# EAGLE design feelerBox1_2_3 (EAGLE 7.2.0)
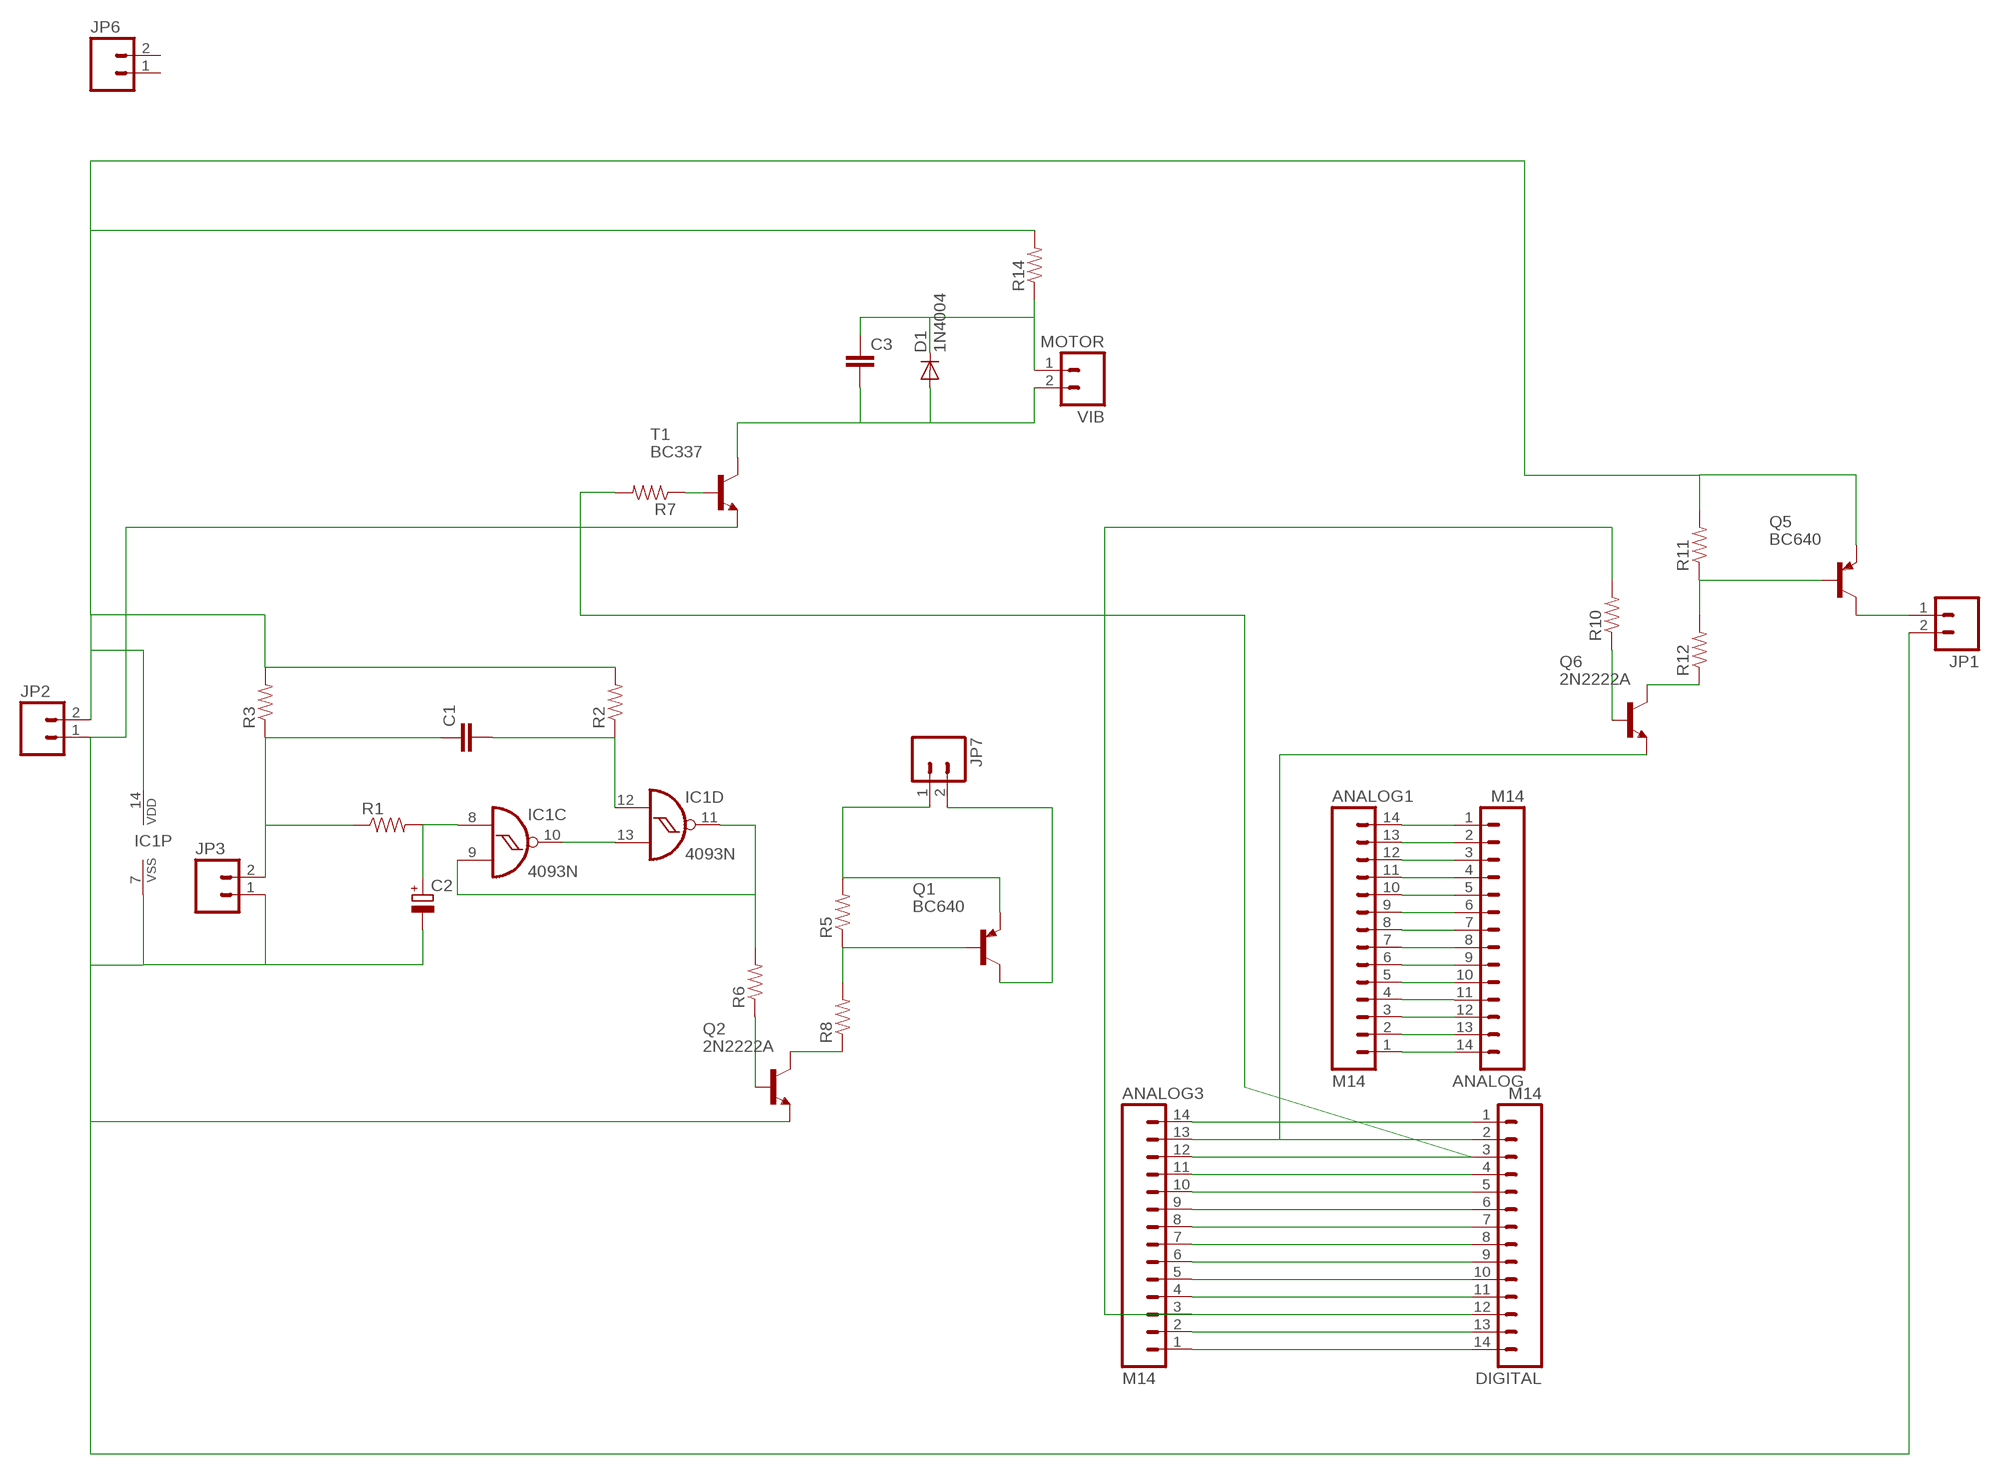
[diagram p0: schematic, sheet 1]

## Parts
ANALOG  M14  [1X14]
ANALOG1  M14  [1X14]
ANALOG3  M14  [1X14]
C1  0.1UF-50V-20%(PTH)KIT-EZ  [CAP-PTH-SMALL-KIT]
C2  CPOL-EUE2.5-5  [E2,5-5]
C3  CAPKIT  [CAP-PTH-SMALL-KIT]
D1  1N4004  [DO41-10]
DIGITAL  M14  [1X14]
IC1  4093N  [DIL14]
JP1  M02PTH  [1X02]
JP2  M02PTH  [1X02]
JP3  M02PTH  [1X02]
JP6  M02PTH  [1X02]
JP7  M02PTH  [1X02]
Q1  BC640  [TO92-BCE]
Q2  2N2222A  [TO18]
Q5  BC640  [TO92-BCE]
Q6  2N2222A  [TO18]
R1  RESISTORAXIAL-0.3  [AXIAL-0.3]
R2  RESISTORAXIAL-0.3  [AXIAL-0.3]
R3  RESISTORAXIAL-0.3  [AXIAL-0.3]
R5  RESISTORPTH-1/4W-VERT  [AXIAL-0.1]
R6  RESISTORAXIAL-0.3  [AXIAL-0.3]
R7  RESISTORAXIAL-0.3  [AXIAL-0.3]
R8  RESISTORAXIAL-0.3  [AXIAL-0.3]
R10  RESISTORPTH-1/4W-VERT  [AXIAL-0.1]
R11  RESISTORPTH-1/4W-VERT  [AXIAL-0.1]
R12  RESISTORPTH-1/4W-VERT  [AXIAL-0.1]
R14  RESISTORPTH-1/4W-VERT  [AXIAL-0.1]
T1  BC337  [TO92]
VIB  MOTOR  M02PTH  [1X02]

## Nets
A1: IC1.9(C:I1) IC1.11(D:O) R6.P$2
A2: ANALOG1.6 ANALOG.9
A3: ANALOG1.5 ANALOG.10
A4: ANALOG1.4 ANALOG.11
A5: ANALOG1.3 ANALOG.12
A6: ANALOG1.2 ANALOG.13
A7: ANALOG1.1 ANALOG.14
A8: ANALOG3.4 DIGITAL.11
A9: ANALOG3.3 DIGITAL.12 R10.P$2
BATTERYGND: C2.- IC1.7(P:VSS) JP1.2 JP2.1 JP3.1 Q2.1(E) T1.1(E)
BATTERYPWR: IC1.14(P:VDD) JP2.2 Q5.E R2.P$2 R3.P$2 R11.P$2 R14.P$2
D2: ANALOG3.12 DIGITAL.3 R7.P$2
D4: ANALOG3.10 DIGITAL.5
D6: ANALOG3.8 DIGITAL.7
D7: ANALOG3.7 DIGITAL.8
D8: ANALOG3.6 DIGITAL.9
D9: ANALOG3.5 DIGITAL.10
GND: ANALOG3.13 DIGITAL.2 Q6.1(E)
GND2: ANALOG3.14 DIGITAL.1
N$1: IC1.10(C:O) IC1.13(D:I1)
N$2: Q1.B R5.P$1 R8.P$2
N$3: C2.+ IC1.8(C:I0) R1.P$2
N$5: ANALOG1.9 ANALOG.6
N$6: C1.1 JP3.2 R1.P$1 R3.P$1
N$7: C1.2 IC1.12(D:I0) R2.P$1
N$8: Q2.3(C) R8.P$1
N$9: JP7.2 Q1.C
N$10: Q2.2(B) R6.P$1
N$11: JP7.1 Q1.E R5.P$2
N$12: ANALOG1.14 ANALOG.1
N$13: ANALOG1.13 ANALOG.2
N$14: ANALOG1.12 ANALOG.3
N$15: ANALOG1.11 ANALOG.4
N$16: ANALOG1.10 ANALOG.5
N$17: R7.P$1 T1.2(B)
N$18: ANALOG1.8 ANALOG.7
N$19: ANALOG1.7 ANALOG.8
N$24: Q5.B R11.P$1 R12.P$2
N$26: ANALOG3.1 DIGITAL.14
N$27: ANALOG3.2 DIGITAL.13
N$29: ANALOG3.9 DIGITAL.6
N$30: ANALOG3.11 DIGITAL.4
N$36: Q6.3(C) R12.P$1
N$37: C3.2 D1.A T1.3(C) VIB.2
N$38: C3.1 D1.C R14.P$1 VIB.1
N$39: Q6.2(B) R10.P$1
N$41: JP1.1 Q5.C
Unconnected: IC1.1(A:I0) IC1.2(A:I1) IC1.3(A:O) IC1.4(B:O) IC1.5(B:I0) IC1.6(B:I1) JP6.1 JP6.2

## Library data of the parts
ANALOG ANALOG1 ANALOG3 DIGITAL = SparkFun:M14: Header 14 Standard 14-pin 0.1" header. Use with straight break away headers (SKU : PRT-00116), right angle break away headers (PRT-00553), swiss pins (PRT-00743), machine pins (PRT-00117), and female headers (PRT-00115).
C1 = SparkFun-Capacitors:0.1UF-50V-20%(PTH): CAP-08370; PROD_ID: CAP-08370
C2 = rcl:CPOL-EU: POLARIZED CAPACITOR, European symbol
C3 = SparkFun-Capacitors:CAP: Capacitor Standard 0603 ceramic capacitor, and 0.1" leaded capacitor.
D1 = diode:1N4004: DIODE general purpose rectifier, 1 A
IC1 = 40xx:4093: Quad 2-input NAND schmitt trigger
JP1-JP3 JP6 JP7 VIB = SparkFun:M02: Header 2 Standard 2-pin 0.1" header. Use with straight break away headers (SKU : PRT-00116), right angle break away headers (PRT-00553), swiss pins (PRT-00743), machine pins (PRT-00117), and female headers (PRT-00115). Molex polarized connector foot print use with SKU : PRT-08233 with associated crimp pins and housings.
Q1 Q5 = transistor-pnp:BC640*: PNP Transistror
Q2 Q6 = transistor-npn:2N2222*: NPN Transistor
R1-R3 R5-R8 R10-R12 R14 = SparkFun-Resistors:RESISTOR: Resistor Basic schematic elements and footprints for 0603, 1206, and PTH resistors.
T1 = transistor:BC337: NPN TRANSISTOR

## Net classes
0 Default: width 0.203 mm
1 VCC: width 0.381 mm
2 LEDPower: width 0.203 mm
3 ButtonSignal: width 0.203 mm

## Board
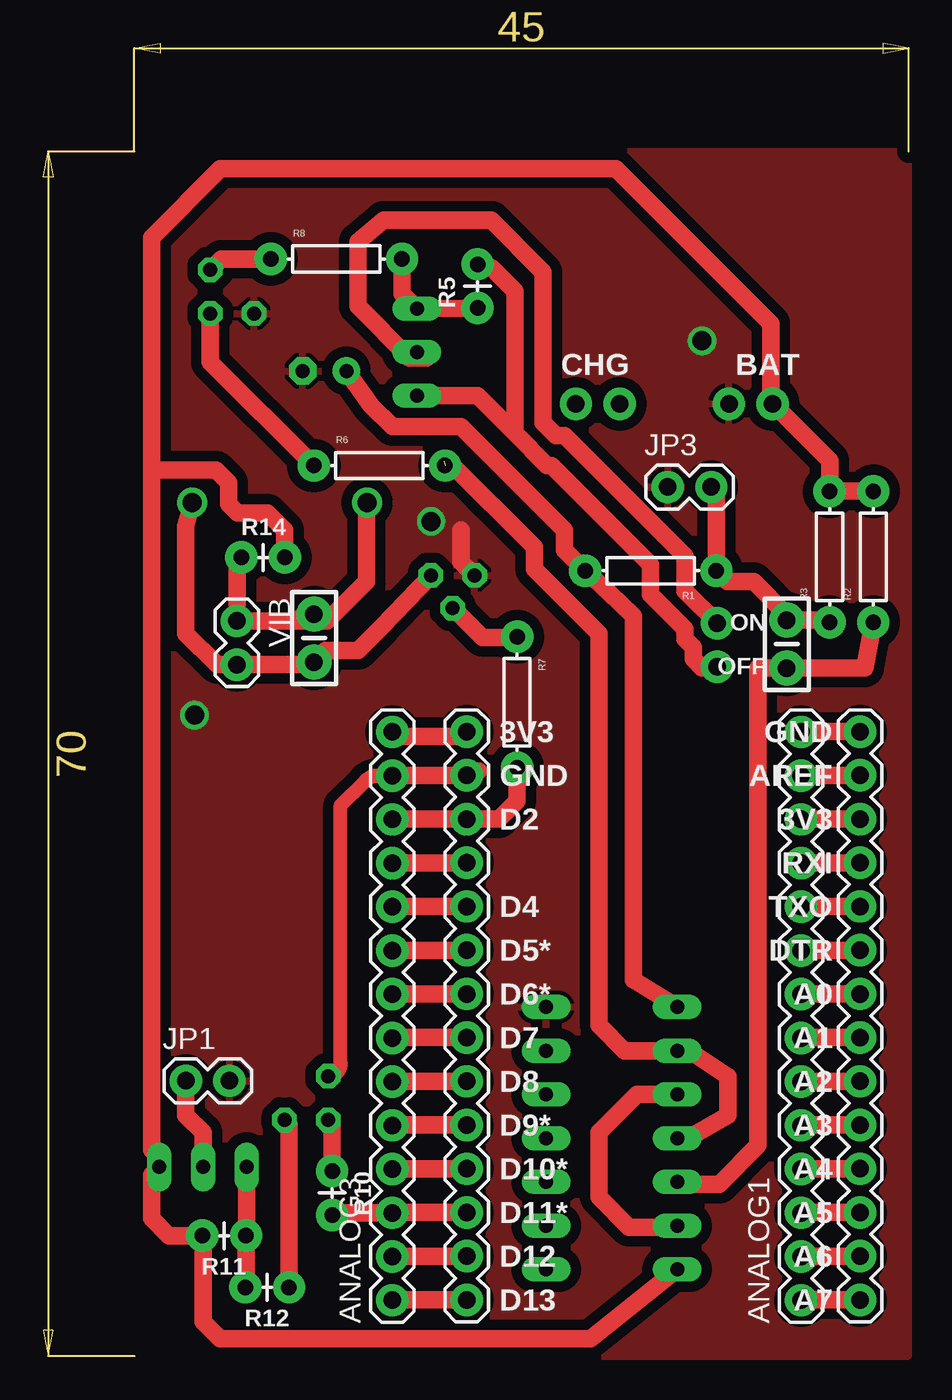
[diagram p1: board, top side]
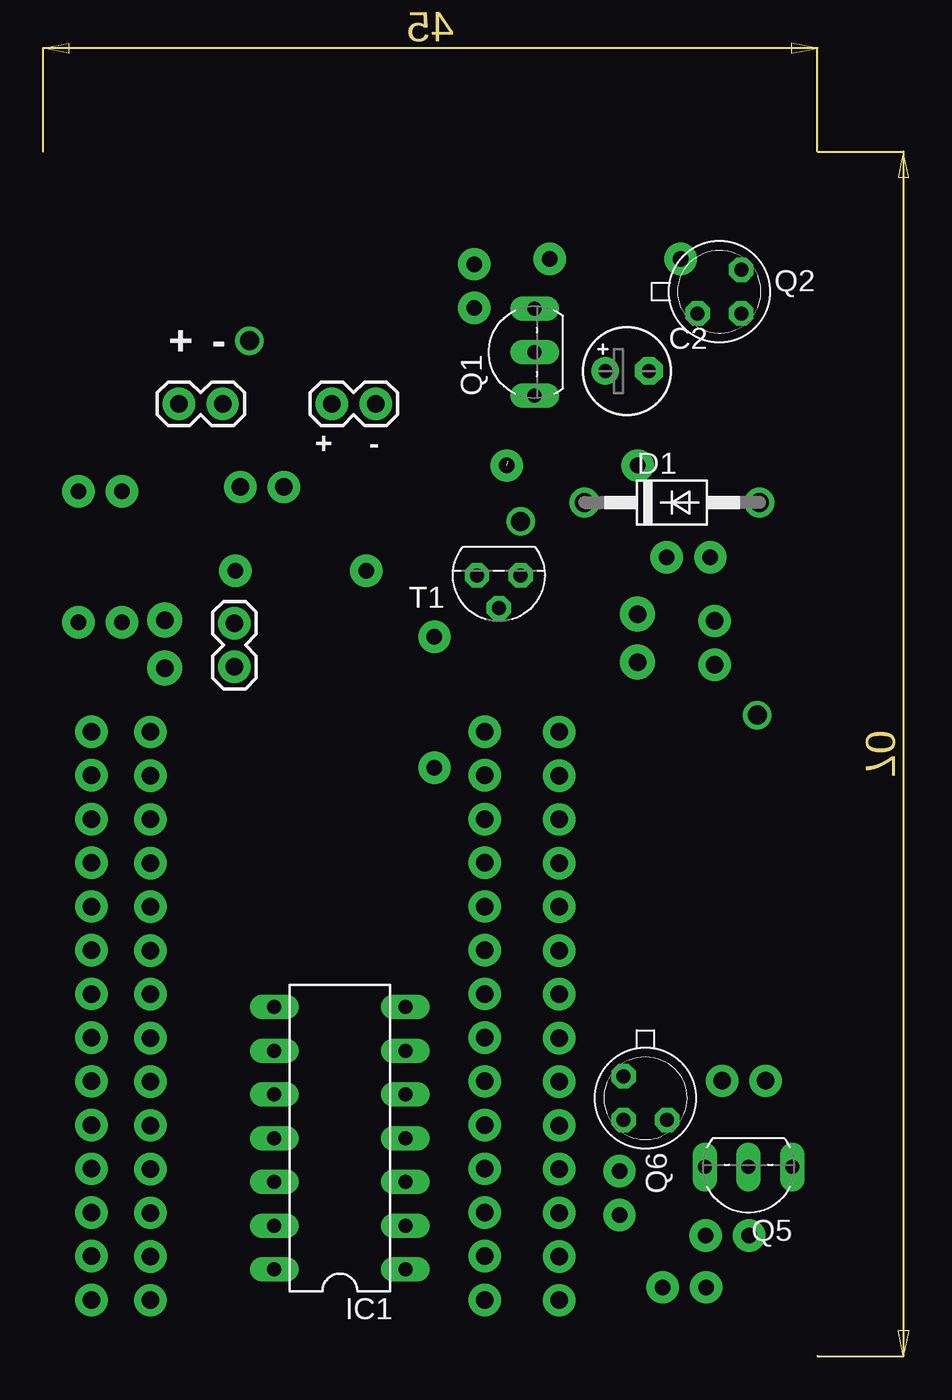
[diagram p2: board, bottom side, seen from below]

Size 50.3 x 76.3 mm. Coordinates in mm from the lower left corner, seen from the top.
Copper layers (1*16): Top 0.035mm / dielectric 1.5mm / Bottom 0.035mm
Design rules "SparkFun *": minimum track width 8mil, minimum drill 20mil, track to track 8mil, track to pad 8mil, pad to pad 8mil, via to via 8mil, smd to smd 8mil, copper to edge 10mil, drill to drill 8mil, minimum pad ring 12mil, minimum via ring 10mil, stop-mask expansion 4mil, vias tented up to drill 25mil, thermal gap 10mil

### Footprints (pad centres in the part's own frame; a part is rotated, then mirrored left to right if it is on the bottom)
1X14 = drill 1.016 pad 1.88: 1 0,0; 2 2.54,0; 3 5.08,0; 4 7.62,0; 5 10.16,0; 6 12.7,0; 7 15.24,0; 8 17.78,0; 9 20.32,0; 10 22.86,0; 11 25.4,0; 12 27.94,0; 13 30.48,0; 14 33.02,0
CAP-PTH-SMALL-KIT = drill 1.016 pad 2.032: 1 -1.397,0; 2 1.397,0
E2,5-5 = drill 0.813 pad 1.6: + -1.27,0 | drill 0.813 pad 1.6 octagon: - 1.27,0
DO41-10 = drill 1.118: A 5.08,0; C -5.08,0
DIL14 = drill 0.813 long: 1 -7.62,-3.81; 2 -5.08,-3.81; 3 -2.54,-3.81; 4 0,-3.81; 5 2.54,-3.81; 6 5.08,-3.81; 7 7.62,-3.81; 8 7.62,3.81; 9 5.08,3.81; 10 2.54,3.81; 11 0,3.81; 12 -2.54,3.81; 13 -5.08,3.81; 14 -7.62,3.81
1X02 = drill 1.016 pad 1.88: 1 0,0; 2 2.54,0
TO92-BCE = drill 0.813 long: B 2.54,0; C 0,0; E -2.54,0
TO18 = drill 0.813 octagon: 1 -1.27,-1.27; 2 1.27,-1.27; 3 1.27,1.27
AXIAL-0.3 = drill 0.9 pad 1.88: P$1 -3.81,0; P$2 3.81,0
AXIAL-0.1 = drill 0.9 pad 1.88: P$1 0,0; P$2 2.54,0
TO92 = drill 0.813 octagon: 1 1.27,0; 2 0,1.905; 3 -1.27,0

### Placement (x,y rotation side)
ANALOG  47.48,36.29 270 top
ANALOG1  44.05,3.25 90 top
ANALOG3  20.3,3.25 90 top
C1  43.22,41.37 270 top
C2  16.36,57.24 0 bottom
C3  15.75,41.72 270 top
D1  13.75,49.6 0 bottom
DIGITAL  24.62,36.29 270 top
IC1  33.05,12.67 90 bottom
JP1  8.3,16 0 top
JP2  39.86,55.34 180 bottom
JP3  36.3,50.5 0 top
JP6  30.97,55.34 180 bottom
JP7  39.17,40.05 90 bottom
Q1  21.73,58.34 90 bottom
Q2  10.99,61.86 0 bottom
Q5  9.3,11 180 bottom
Q6  15.3,15 270 bottom
R1  35.32,45.64 180 top
R2  48.25,46.45 90 top
R3  45.71,46.45 90 top
R5  25.25,60.91 90 top
R6  19.55,51.75 0 top
R7  27.55,38 270 top
R8  17.05,63.75 0 top
R10  16.8,10.75 270 top
R11  11.8,7 180 top
R12  14.3,4 180 top
R14  11.52,46.41 0 top
T1  23.81,45.37 180 bottom
VIB  11.27,42.72 270 top

### Tracks (layer width: path | path; a pad name or v marks a point on that pad's centre or on a via)
A1  (1 unrouted)
  Top 1.016: IC1.11 37.47,12.67 39.8,14 39.8,16.25 37.55,17.75 IC1.9 33.8,17.75 32.3,19.25 32.3,42 28.55,45.75 28.55,47 23.55,52 23.3,52
A2
  Top 1.016: ANALOG1.6 44.07,15.97 ANALOG.9
A3
  Top 1.016: ANALOG1.5 44.07,13.43 ANALOG.10
A4
  Top 1.016: ANALOG1.4 44.07,10.89 ANALOG.11
A5
  Top 1.016: ANALOG1.3 44.07,8.35 ANALOG.12
A6
  Top 1.016: ANALOG1.2 44.07,5.81 ANALOG.13
A7
  Top 1.016: ANALOG1.1 44.07,3.27 ANALOG.14
A8
  Top 1.016: ANALOG3.4 20.32,10.89 DIGITAL.11
A9
  Top 1.016: R10.P$2 16.92,8.33 ANALOG3.3 20.32,8.35 DIGITAL.12
BATTERYGND  (via drill 1.1)
  Top 0.813: JP2.1 39.52,55
  Top 1.016: T1.1 24.3,46.15 24.3,48
  other vias: 38.3,59 8.8,37.25 22.55,48.5
  pour Top (isolate 0.61): 5.3,0 50.3,0 50.3,70 5.3,70
BATTERYPWR
  Top 1.016: 6.3,51.5 6.3,65 10.3,69 33.3,69 42.3,60 42.3,55.44 JP2.2 45.71,52.03 R3.P$2 R2.P$2 | 6.3,51.5 6.3,12 6.76,11.54 Q5.E 6.3,10.54 6.3,8 7.3,7 R11.P$2 9.3,6.96 9.3,2 10.3,1 31.81,1 IC1.14 | R14.P$2 14.05,48 13.05,49 11.3,49 10.8,49.5 10.8,50.75 10.05,51.5 6.3,51.5
D2
  Top 1.016: ANALOG3.12 20.32,31.21 DIGITAL.3 26.51,31.21 27.55,32.25 R7.P$2
D4
  Top 1.016: ANALOG3.10 20.32,26.13 DIGITAL.5
D6
  Top 1.016: ANALOG3.8 20.32,21.05 DIGITAL.7
D7
  Top 1.016: ANALOG3.7 20.32,18.51 DIGITAL.8
D8
  Top 1.016: 24.35,15.7 DIGITAL.9 20.32,15.97 ANALOG3.6
D9
  Top 1.016: 24.35,13.16 DIGITAL.10 20.32,13.43 ANALOG3.5
GND
  Top 0.813: Q6.1 arc90 17.3,17 17.3,32 18.74,33.44 arc-45 19.44,33.73 ANALOG3.13
  Top 1.016: 24.35,33.48 DIGITAL.2 20.32,33.75 ANALOG3.13
GND2
  Top 1.016: 24.35,36.02 DIGITAL.1 24.59,36.29 24.3,36 20.57,36 ANALOG3.14
N$1
  Top 1.016: IC1.13 35.77,7.5 34.05,7.5 32.3,9.25 32.3,13 34.51,15.21 IC1.10
N$2
  Top 1.016: R5.P$1 21.97,60.88 Q1.B 20.86,61.75 R8.P$2
N$3
  Top 1.016: IC1.8 34.3,21.85 34.3,43 33.51,43.79 R1.P$2 30.3,46.85 30.3,48 24.3,54 20.3,54 19.06,55.24 C2.+
N$5
  Top 1.016: ANALOG1.9 44.07,23.59 ANALOG.6
N$6
  Top 1.016: JP3.2 39.13,50.21 R1.P$1 39.77,45 41.3,45 43.22,43.08 C1.1 45.58,42.77 R3.P$1
N$7
  Top 1.016: R2.P$1 47.75,39.97 C1.2 41.55,39.97 41.55,12.25 39.3,10 35.99,10 IC1.12
N$8
  Top 1.016: Q2.3 10.34,63.75 R8.P$1
N$9
  Top 1.016: JP7.2 37.3,44.47 37.3,46.5 30.3,53.5 29.8,53.5 29.05,54.25 29.05,63 26.05,66 19.8,66 18.3,64.75 18.3,61 21.3,58 22.3,58 21.96,58.34 Q1.C
N$10
  Top 1.016: R6.P$1 9.72,57.77 Q2.2
N$11
  Top 1.016: JP7.1 39.3,40 38.3,40 37.8,40.5 37.8,41.17 37.3,41.67 37.3,42.25 35.3,44.25 35.3,46 29.55,51.75 29.3,51.75 27.43,53.62 | 27.43,53.62 25.25,55.8 Q1.E | R5.P$2 25.45,63.25 26.05,63.25 27.43,61.88 27.43,53.62
N$12
  Top 1.016: ANALOG1.14 44.07,36.29 ANALOG.1
N$13
  Top 1.016: ANALOG1.13 44.07,33.75 ANALOG.2
N$14
  Top 1.016: ANALOG1.12 44.07,31.21 ANALOG.3
N$15
  Top 1.016: ANALOG1.11 44.07,28.67 ANALOG.4
N$16
  Top 1.016: ANALOG1.10 44.07,26.13 ANALOG.5
N$17
  Top 1.016: R7.P$1 27.49,41.75 25.55,41.75 23.84,43.47 T1.2
N$18
  Top 1.016: ANALOG1.8 44.07,21.05 ANALOG.7
N$19
  Top 1.016: ANALOG1.7 44.07,18.51 ANALOG.8
N$24
  Top 1.016: R12.P$2 11.8,4.04 R11.P$1 11.84,7.04 Q5.B
N$25
  Top 1.016: 25.3,34 24.8,33.5
N$26
  Top 1.016: 24.35,3 DIGITAL.14 20.32,3.27 ANALOG3.1
N$27
  Top 1.016: 24.35,5.54 DIGITAL.13 20.32,5.81 ANALOG3.2
N$29
  Top 1.016: ANALOG3.9 20.32,23.59 DIGITAL.6
N$30
  Top 1.016: 24.35,28.4 DIGITAL.4 20.32,28.67 ANALOG3.11
N$36
  Top 0.254: Q6.3 14.3,13.46
  Top 1.016: 14.3,13.46 R12.P$1
N$37
  Top 1.016: D1.A 8.3,48.23 8.3,42 10.12,40.18 VIB.2 15.61,40.18 C3.2 16.43,41 18.3,41 19.67,42.37 T1.3
N$38
  Top 1.016: R14.P$1 11.27,45.66 VIB.1 14.35,42.72 | C3.1 14.35,42.72 | D1.C 18.8,49.57 18.8,45 16.52,42.72 14.35,42.72
N$39
  Top 1.016: Q6.2 16.8,13.5 R10.P$1
N$41
  Top 1.016: Q5.C 9.3,13 8.3,14 JP1.1

### Text on the board
tPlace: CHG | BAT | ON | OFF | GND | 3V3 | AREF | GND | 3V3 | D2 | RXI | TXO | D4 | DTR | D5* | A0 | D6* | A1 | D7 | A2 | D8 | A3 | D9* | A4 | D10* | A5 | D11* | A6 | D12 | A7 | D13
bPlace: - | + | - | +